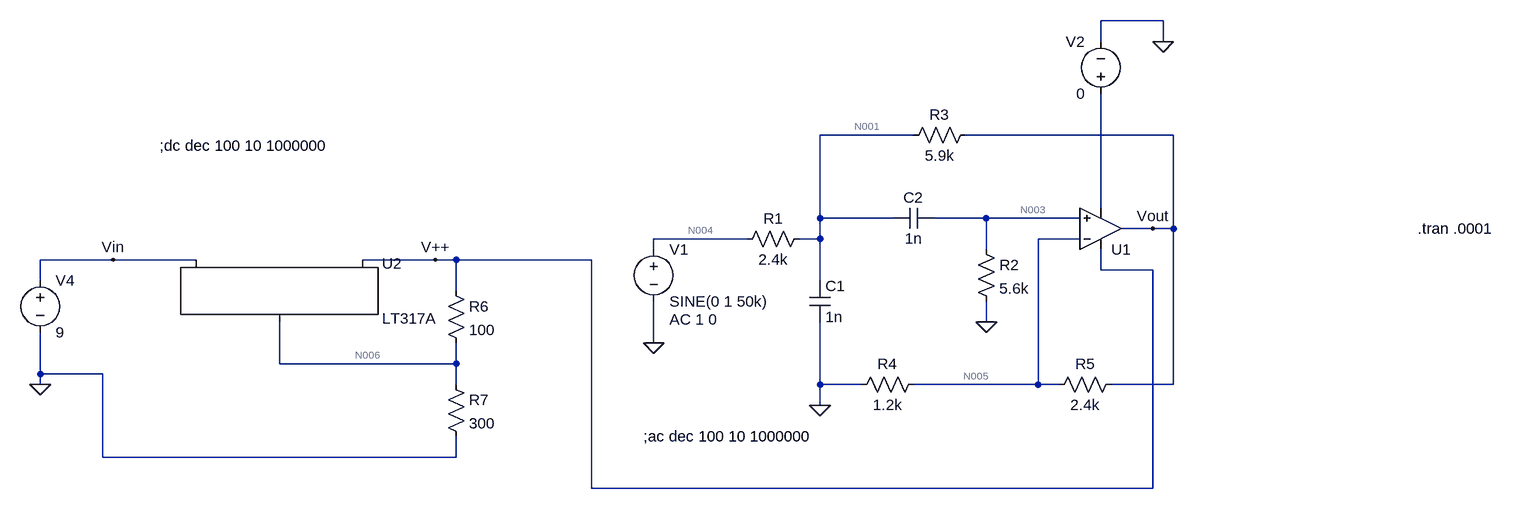
[diagram p0: schematic BandPassFilter2ndOrderBessel.asc]
BandPassFilter2ndOrderBessel.asc, the LTspice schematic file:
Version 4
SHEET 1 1260 680
WIRE 736 -160 640 -160
WIRE 640 -128 640 -160
WIRE 736 -128 736 -160
WIRE 352 16 208 16
WIRE 752 16 432 16
WIRE 640 128 640 -48
WIRE 208 144 208 16
WIRE 320 144 208 144
WIRE 464 144 384 144
WIRE 608 144 464 144
WIRE 720 160 672 160
WIRE 752 160 752 16
WIRE 752 160 720 160
WIRE 96 176 -48 176
WIRE 208 176 208 144
WIRE 208 176 176 176
WIRE 608 176 544 176
WIRE -48 192 -48 176
WIRE 464 192 464 144
WIRE -880 208 -992 208
WIRE -752 208 -880 208
WIRE -384 208 -496 208
WIRE -352 208 -384 208
WIRE -144 208 -352 208
WIRE 640 224 640 192
WIRE 720 224 640 224
WIRE -992 240 -992 208
WIRE 208 240 208 176
WIRE -352 256 -352 208
WIRE 464 304 464 272
WIRE -48 336 -48 272
WIRE -624 368 -624 304
WIRE -352 368 -352 336
WIRE -352 368 -624 368
WIRE -992 384 -992 320
WIRE -896 384 -992 384
WIRE -992 400 -992 384
WIRE -352 400 -352 368
WIRE 208 400 208 304
WIRE 272 400 208 400
WIRE 544 400 544 176
WIRE 544 400 352 400
WIRE 576 400 544 400
WIRE 752 400 752 160
WIRE 752 400 656 400
WIRE 208 432 208 400
WIRE -896 512 -896 384
WIRE -352 512 -352 480
WIRE -352 512 -896 512
WIRE -144 560 -144 208
WIRE 720 560 720 224
WIRE 720 560 -144 560
FLAG 736 -128 0
FLAG -48 336 0
FLAG 464 304 0
FLAG 208 432 0
FLAG -992 400 0
FLAG -880 208 Vin
FLAG -384 208 V++
FLAG 720 160 Vout
SYMBOL voltage -48 176 R0
WINDOW 123 24 124 Left 2
WINDOW 39 0 0 Left 0
SYMATTR Value2 AC 1 0
SYMATTR InstName V1
SYMATTR Value SINE(0 1 50k)
SYMBOL res 192 160 R90
WINDOW 0 0 56 VBottom 2
WINDOW 3 32 56 VTop 2
SYMATTR InstName R1
SYMATTR Value 2.4k
SYMBOL cap 192 240 R0
SYMATTR InstName C1
SYMATTR Value 1n
SYMBOL cap 384 128 R90
WINDOW 0 0 32 VBottom 2
WINDOW 3 32 32 VTop 2
SYMATTR InstName C2
SYMATTR Value 1n
SYMBOL res 448 176 R0
SYMATTR InstName R2
SYMATTR Value 5.6k
SYMBOL res 448 0 R90
WINDOW 0 0 56 VBottom 2
WINDOW 3 32 56 VTop 2
SYMATTR InstName R3
SYMATTR Value 5.9k
SYMBOL res 368 384 R90
WINDOW 0 0 56 VBottom 2
WINDOW 3 32 56 VTop 2
SYMATTR InstName R4
SYMATTR Value 1.2k
SYMBOL res 672 384 R90
WINDOW 0 0 56 VBottom 2
WINDOW 3 32 56 VTop 2
SYMATTR InstName R5
SYMATTR Value 2.4k
SYMBOL OpAmps\\UniversalOpAmp 640 160 M180
SYMATTR InstName U1
SYMBOL voltage 640 -32 R180
WINDOW 0 24 96 Left 2
WINDOW 3 24 16 Left 2
WINDOW 123 0 0 Left 0
WINDOW 39 0 0 Left 0
SYMATTR InstName V2
SYMATTR Value 0
SYMBOL voltage -992 224 R0
WINDOW 123 0 0 Left 0
WINDOW 39 0 0 Left 0
SYMATTR InstName V4
SYMATTR Value 9
SYMBOL PowerProducts\\LT317A -624 208 R0
SYMATTR InstName U2
SYMBOL res -368 240 R0
SYMATTR InstName R6
SYMATTR Value 100
SYMBOL res -368 384 R0
SYMATTR InstName R7
SYMATTR Value 300
TEXT -64 480 Left 2 !;ac dec 100 10 1000000
TEXT 1128 160 Left 2 !.tran .0001
TEXT -808 32 Left 2 !;dc dec 100 10 1000000

The netlist it stands for:
* BandPassFilter2ndOrderBessel.asc
V1 N004 0 SINE(0 1 50k) AC 1 0
R1 N001 N004 2.4k
C1 N001 0 1n
C2 N003 N001 1n
R2 N003 0 5.6k
R3 Vout N001 5.9k
R4 N005 0 1.2k
R5 Vout N005 2.4k
XU1 N003 N005 V++ N002 Vout level1 Avol=1Meg GBW=10Meg Vos=0 En=0 Enk=0 In=0 Ink=0 Rin=500Meg  ; pins In+ In- V+ V- OUT
V2 N002 0 0
V4 Vin 0 9
XU2 N006 V++ Vin LT317A
R6 V++ N006 100
R7 N006 0 300
;ac dec 100 10 1000000
.tran .0001
;dc dec 100 10 1000000
.lib UniversalOpAmp1.lib
.lib LTC.lib
.backanno
.end

* Results of the author's LTspice run, read from the files saved beside the schematic
* Operating Point, zero values left out:
*   V(n001) = 20.83 µV
*   V(n003) = 28.02 µV
*   V(vout) = 72.05 µV
*   V(n005) = 28.02 µV
*   V(v++) = 5.004 V
*   V(vin) = 9 V
*   V(n006) = 3.756 V
*   I(R7) = 12.52 mA
*   I(R6) = 12.47 mA
*   I(R5) = 18.35 nA
*   I(R4) = 23.35 nA
*   I(R3) = 8.681 nA
*   I(R2) = 5.004 nA
*   I(R1) = 8.681 nA
*   I(V4) = -12.52 mA
*   I(V1) = 8.681 nA
*   Ix(u1:1) = -5.004 nA
*   Ix(u1:2) = -5.004 nA
*   Ix(u1:3) = 10.01 nA
*   Ix(u1:5) = -23.63 nA
*   Ix(u2:1) = -47.51 µA
*   Ix(u2:2) = -12.47 mA
*   Ix(u2:3) = 12.52 mA
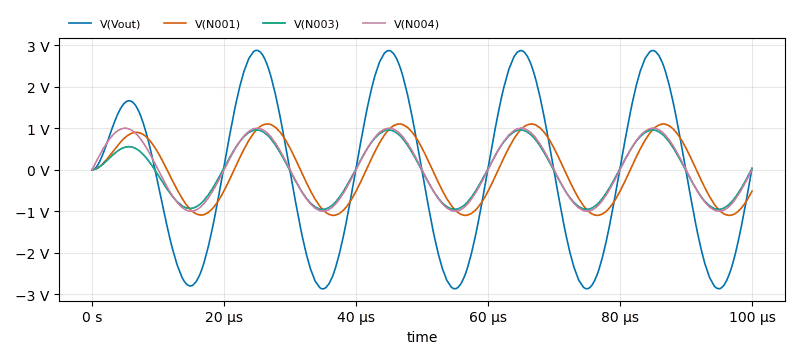
[diagram p1: Transient Analysis of BandPassFilter2ndOrderBessel.asc, plotted from the saved traces]
* Transient Analysis, 1 run:
*   V(Vout): min -2.871 V, max 2.876 V, average -91.18 mV, rms 1.954 V, last 31.9 mV
*   V(N001): min -1.101 V, max 1.103 V, average -8.222 mV, rms 764.9 mV, last -519.1 mV
*   V(N003): min -957.7 mV, max 959.1 mV, average -30.39 mV, rms 651.4 mV, last 25 mV
*   V(N004): min -1 V, max 999.7 mV, average 50.4 µV, rms 706.7 mV, last 0 V